# Altium project WR_NIC.PrjPcb (part 2 of 6)

## Sheet 06-General I2C Devices.SchDoc
size B; SheetNumber: 6; SheetTotal: 22
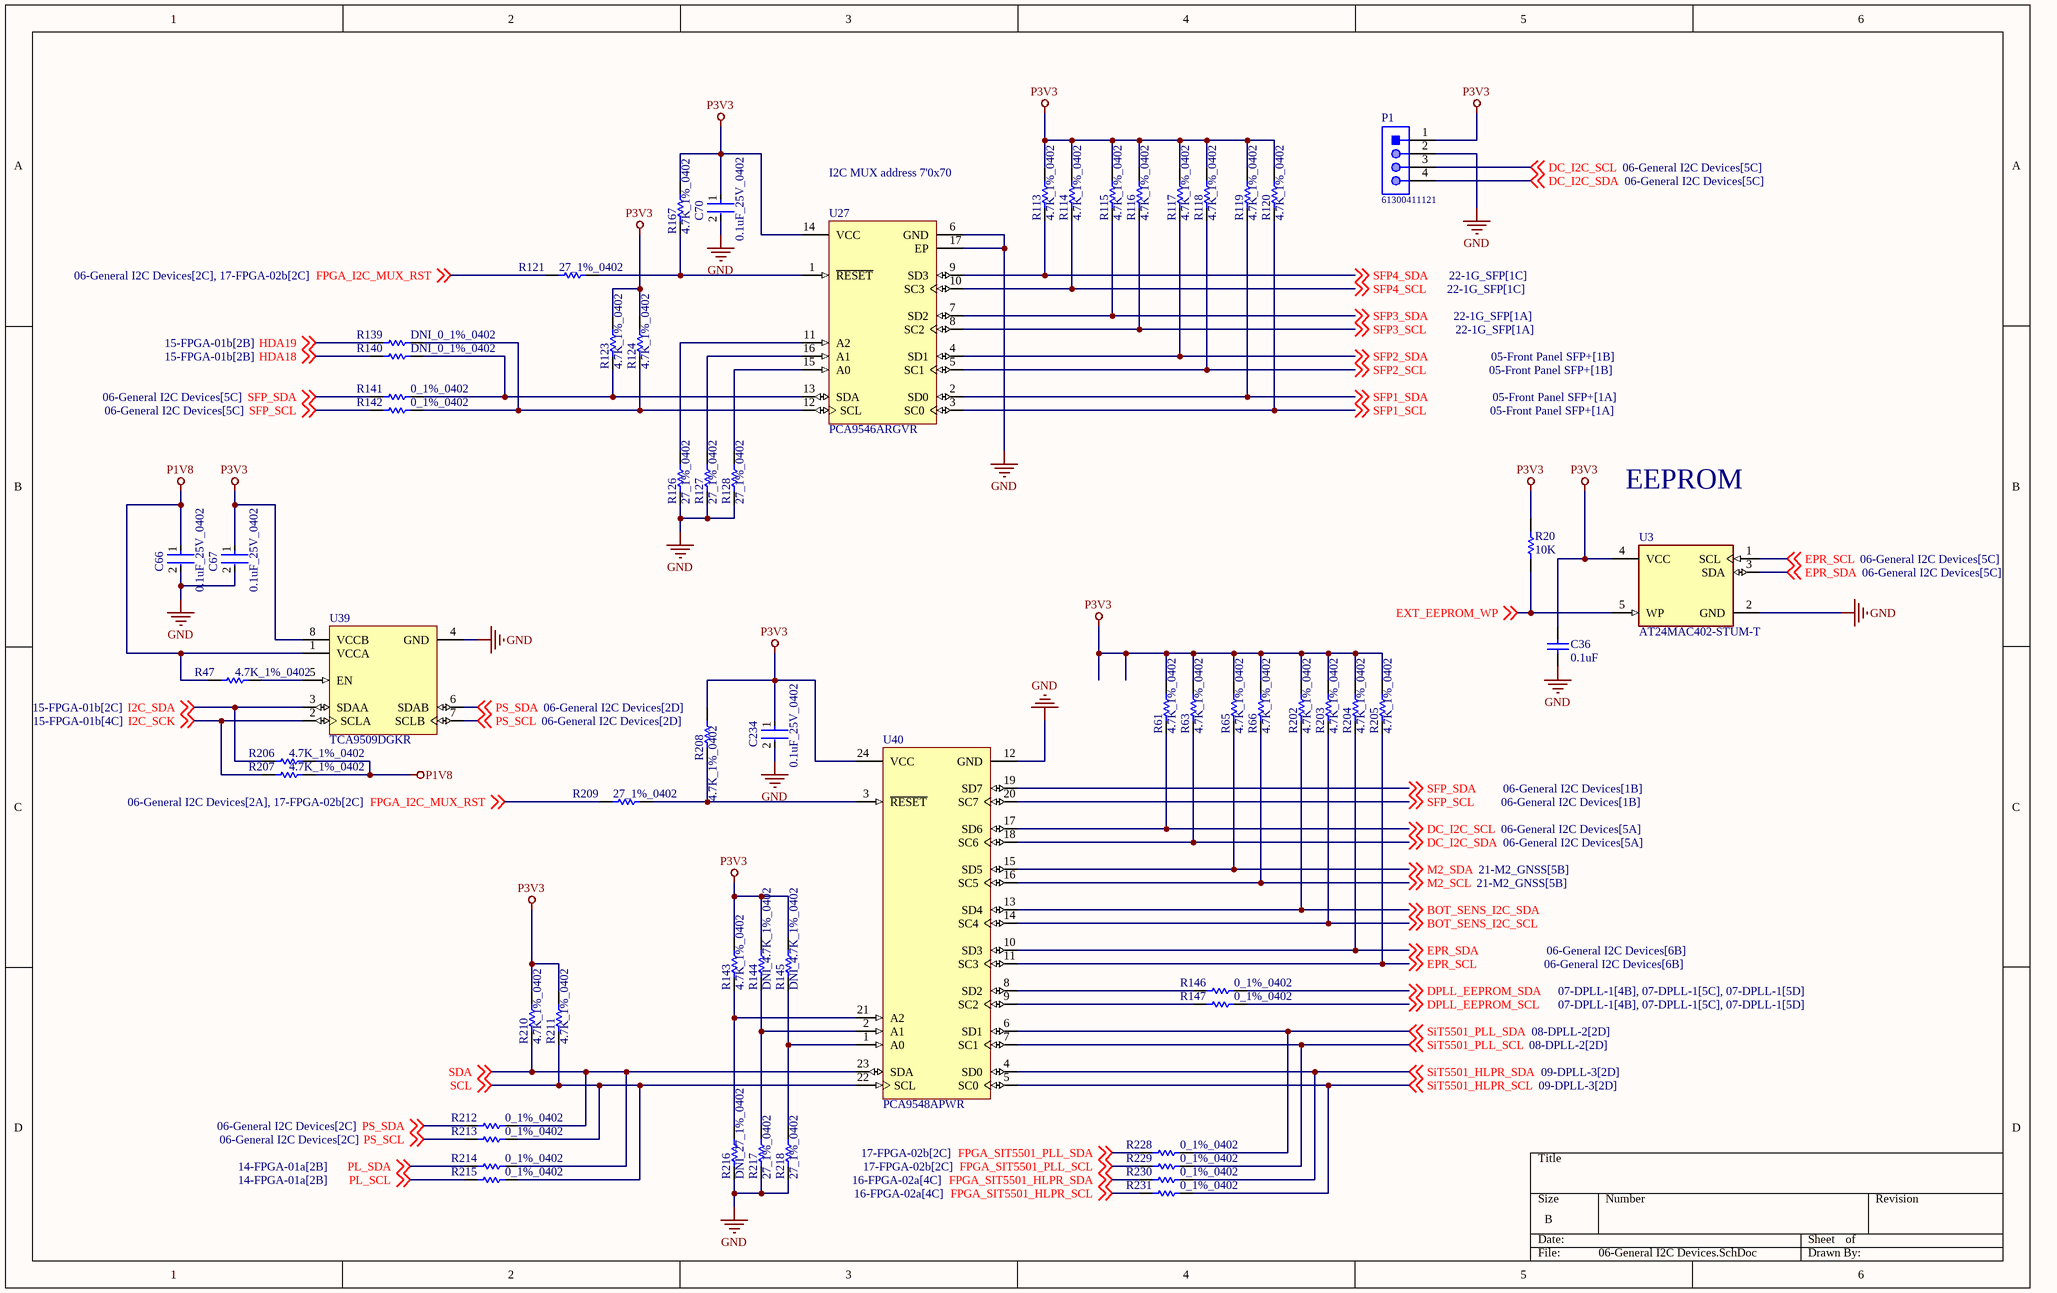
[diagram p5: 06-General I2C Devices.SchDoc]

### Parts
C36  0.1uF  [CAPC1608X87X45ML20T05]
C66  0.1uF_25V_0402  [FP-0402-L_1_0_1-W_0_5_0_1-IPC_C]
C67  0.1uF_25V_0402  [FP-0402-L_1_0_1-W_0_5_0_1-IPC_C]
C70  0.1uF_25V_0402  [FP-0402-L_1_0_1-W_0_5_0_1-IPC_C]
C234  0.1uF_25V_0402  [FP-0402-L_1_0_1-W_0_5_0_1-IPC_C]
P1  61300411121  [61300411121]
R20  10K  [RESC1608X55X30LL15T20]
R47  4.7K_1%_0402  [RESC1005X40X25NL10T10]
R61  4.7K_1%_0402  [RESC1005X40X25NL10T10]
R63  4.7K_1%_0402  [RESC1005X40X25NL10T10]
R65  4.7K_1%_0402  [RESC1005X40X25NL10T10]
R66  4.7K_1%_0402  [RESC1005X40X25NL10T10]
R113  4.7K_1%_0402  [RESC1005X40X25NL10T10]
R114  4.7K_1%_0402  [RESC1005X40X25NL10T10]
R115  4.7K_1%_0402  [RESC1005X40X25NL10T10]
R116  4.7K_1%_0402  [RESC1005X40X25NL10T10]
R117  4.7K_1%_0402  [RESC1005X40X25NL10T10]
R118  4.7K_1%_0402  [RESC1005X40X25NL10T10]
R119  4.7K_1%_0402  [RESC1005X40X25NL10T10]
R120  4.7K_1%_0402  [RESC1005X40X25NL10T10]
R121  27_1%_0402  [RESC1005X40X25NL05T05]
R123  4.7K_1%_0402  [RESC1005X40X25NL10T10]
R124  4.7K_1%_0402  [RESC1005X40X25NL10T10]
R126  27_1%_0402  [RESC1005X40X25NL05T05]
R127  27_1%_0402  [RESC1005X40X25NL05T05]
R128  27_1%_0402  [RESC1005X40X25NL05T05]
R139  DNI_0_1%_0402  [RESC1005X40X25LL05T05]  (no BOM)
R140  DNI_0_1%_0402  [RESC1005X40X25LL05T05]  (no BOM)
R141  0_1%_0402  [RESC1005X40X25LL05T05]
R142  0_1%_0402  [RESC1005X40X25LL05T05]
R143  4.7K_1%_0402  [RESC1005X40X25NL10T10]
R144  DNI_4.7K_1%_0402  [RESC1005X40X25NL10T10]  (no BOM)
R145  DNI_4.7K_1%_0402  [RESC1005X40X25NL10T10]  (no BOM)
R146  0_1%_0402  [RESC1005X40X25LL05T05]
R147  0_1%_0402  [RESC1005X40X25LL05T05]
R167  4.7K_1%_0402  [RESC1005X40X25NL10T10]
R202  4.7K_1%_0402  [RESC1005X40X25NL10T10]
R203  4.7K_1%_0402  [RESC1005X40X25NL10T10]
R204  4.7K_1%_0402  [RESC1005X40X25NL10T10]
R205  4.7K_1%_0402  [RESC1005X40X25NL10T10]
R206  4.7K_1%_0402  [RESC1005X40X25NL10T10]
R207  4.7K_1%_0402  [RESC1005X40X25NL10T10]
R208  4.7K_1%_0402  [RESC1005X40X25NL10T10]
R209  27_1%_0402  [RESC1005X40X25NL05T05]
R210  4.7K_1%_0402  [RESC1005X40X25NL10T10]
R211  4.7K_1%_0402  [RESC1005X40X25NL10T10]
R212  0_1%_0402  [RESC1005X40X25LL05T05]
R213  0_1%_0402  [RESC1005X40X25LL05T05]
R214  0_1%_0402  [RESC1005X40X25LL05T05]
R215  0_1%_0402  [RESC1005X40X25LL05T05]
R216  DNI_27_1%_0402  [RESC1005X40X25NL05T05]  (no BOM)
R217  27_1%_0402  [RESC1005X40X25NL05T05]
R218  27_1%_0402  [RESC1005X40X25NL05T05]
R228  0_1%_0402  [RESC1005X40X25LL05T05]
R229  0_1%_0402  [RESC1005X40X25LL05T05]
R230  0_1%_0402  [RESC1005X40X25LL05T05]
R231  0_1%_0402  [RESC1005X40X25LL05T05]
U3  AT24MAC402-STUM-T  [FP-5TS1-IPC_C]
U27  PCA9546ARGVR  [RGV0016A_V]
U39  TCA9509DGKR  [DGK0008A_L]
U40  PCA9548APWR  [PW0024A_N]

### Nets
GND: C36.1 C66.2 C67.2 C70.2 C234.2 P1.2 R126.1 R127.1 R128.1 R216.1 R217.1 R218.1 U3.2(GND) U27.6(GND) U27.17(EP) U39.4(GND) U40.12(GND)
P1V8: C66.1 R47.2 R206.1 R207.1 U39.1(VCCA)
P3V3: C36.2 C67.1 C70.1 C234.1 P1.1 R20.2 R61.2 R63.2 R65.2 R66.2 R113.2 R114.2 R115.2 R116.2 R117.2 R118.2 R119.2 R120.2 R123.2 R124.2 R143.2 R144.2 R145.2 R167.2 R202.2 R203.2 R204.2 R205.2 R208.2 R210.2 R211.2 U3.4(VCC) U27.14(VCC) U39.8(VCCB) U40.24(VCC)
BOT_SENS_I2C_SCL: R203.1 U40.14(SC4) ; off-sheet BOT_SENS_I2C_SCL
BOT_SENS_I2C_SDA: R202.1 U40.13(SD4) ; off-sheet BOT_SENS_I2C_SDA
DC_I2C_SCL: P1.3 R61.1 U40.17(SD6) ; off-sheet DC_I2C_SCL
DC_I2C_SDA: P1.4 R63.1 U40.18(SC6) ; off-sheet DC_I2C_SDA
DPLL_EEPROM_SCL: R147.2 ; off-sheet DPLL_EEPROM_SCL
DPLL_EEPROM_SDA: R146.2 ; off-sheet DPLL_EEPROM_SDA
EPR_SCL: R205.1 U3.1(SCL) U40.11(SC3) ; off-sheet EPR_SCL
EPR_SDA: R204.1 U3.3(SDA) U40.10(SD3) ; off-sheet EPR_SDA
EXT_EEPROM_WP: R20.1 U3.5(WP) ; off-sheet EXT_EEPROM_WP
FPGA_I2C_MUX_RST: R121.1 R209.1 ; off-sheet FPGA_I2C_MUX_RST
FPGA_SIT5501_HLPR_SCL: R231.1 ; off-sheet FPGA_SIT5501_HLPR_SCL
FPGA_SIT5501_HLPR_SDA: R230.1 ; off-sheet FPGA_SIT5501_HLPR_SDA
FPGA_SIT5501_PLL_SCL: R229.1 ; off-sheet FPGA_SIT5501_PLL_SCL
FPGA_SIT5501_PLL_SDA: R228.1 ; off-sheet FPGA_SIT5501_PLL_SDA
HDA18: R140.1 ; off-sheet HDA18
HDA19: R139.1 ; off-sheet HDA19
I2C_SCK: R207.2 U39.2(SCLA) ; off-sheet I2C_SCK
I2C_SDA: R206.2 U39.3(SDAA) ; off-sheet I2C_SDA
M2_SCL: R66.1 U40.16(SC5) ; off-sheet M2_SCL
M2_SDA: R65.1 U40.15(SD5) ; off-sheet M2_SDA
PL_SCL: R215.1 ; off-sheet PL_SCL
PL_SDA: R214.1 ; off-sheet PL_SDA
PS_SCL: R213.1 U39.7(SCLB) ; off-sheet PS_SCL
PS_SDA: R212.1 U39.6(SDAB) ; off-sheet PS_SDA
SCL: R211.1 R213.2 R215.2 U40.22(SCL) ; off-sheet SCL
SDA: R210.1 R212.2 R214.2 U40.23(SDA) ; off-sheet SDA
SFP1_SCL: R120.1 U27.3(SC0) ; off-sheet SFP1_SCL
SFP1_SDA: R119.1 U27.2(SD0) ; off-sheet SFP1_SDA
SFP2_SCL: R118.1 U27.5(SC1) ; off-sheet SFP2_SCL
SFP2_SDA: R117.1 U27.4(SD1) ; off-sheet SFP2_SDA
SFP3_SCL: R116.1 U27.8(SC2) ; off-sheet SFP3_SCL
SFP3_SDA: R115.1 U27.7(SD2) ; off-sheet SFP3_SDA
SFP4_SCL: R114.1 U27.10(SC3) ; off-sheet SFP4_SCL
SFP4_SDA: R113.1 U27.9(SD3) ; off-sheet SFP4_SDA
SFP_SCL: R142.1 U40.20(SC7) ; off-sheet SFP_SCL
SFP_SDA: R141.1 U40.19(SD7) ; off-sheet SFP_SDA
SiT5501_HLPR_SCL: R231.2 U40.5(SC0) ; off-sheet SiT5501_HLPR_SCL
SiT5501_HLPR_SDA: R230.2 U40.4(SD0) ; off-sheet SiT5501_HLPR_SDA
SiT5501_PLL_SCL: R229.2 U40.7(SC1) ; off-sheet SiT5501_PLL_SCL
SiT5501_PLL_SDA: R228.2 U40.6(SD1) ; off-sheet SiT5501_PLL_SDA
NetR47_1: R47.1 U39.5(EN)
NetR121_2: R121.2 R167.1 U27.1(~{RESET})
NetR123_1: R123.1 R140.2 R141.2 U27.13(SDA)
NetR124_1: R124.1 R139.2 R142.2 U27.12(SCL)
NetR126_2: R126.2 U27.11(A2)
NetR127_2: R127.2 U27.16(A1)
NetR128_2: R128.2 U27.15(A0)
NetR143_1: R143.1 R216.2 U40.21(A2)
NetR144_1: R144.1 R217.2 U40.2(A1)
NetR145_1: R145.1 R218.2 U40.1(A0)
NetR146_1: R146.1 U40.8(SD2)
NetR147_1: R147.1 U40.9(SC2)
NetR208_1: R208.1 R209.2 U40.3(~{RESET})

### Notes on the sheet
- I2C MUX address 7'0x70
- EEPROM

### Library data of the parts
C36 = CMP-2006-00003-1: C0603X104K5RACAUTO; Manufacturer: Kemet; Part Number: C0603X104K5RACAUTO
C66 C67 C70 C234 = CMP-2008-02519-2: as C19 on sheet 01-PCIe; Package Quantity: 1; Capacitance: 100nF; Min Operating Temperature: -55°C; Voltage: 25V; Voltage Rating: 25V; Construction: Flat; Max Operating Temperature: 125°C; Radiation Hardening: No; Depth: 0.5mm; Thickness: 0.022inch; Voltage Rating (DC): 25V; Number of Pins: 2; Lead Free: Lead Free; Series: -; REACH SVHC: No SVHC; Length: 1mm; Dielectric: X7R; RoHS Compliant: Yes; Mount: Surface Mount; Packaging: Tape and Reel; Case/Package: 0402; Case Code (Imperial): 0402; Termination: SMD/SMT; Width: 0.02inch; Case Code (Metric): 1005; Tolerance: 10%
P1 = CMP-1502-01064-1: THT Vertical Pin Header WR-PHD, Pitch 2.54 mm, Single Row, 4 pins; Manufacturer: Wurth Elektronik; Withstanding Voltage: 500VAC; Rated Current: 3A; Working Voltage: 250VAC; Pin Number: 4; Gender: Male; Contact Resistance: 20mOhm; Pitch: 2.54mm; Manufacturer URL: http://www.we-online.de; Operating Temperature: -40to105degC; Packaging: Bag; Mounting Technology: THT; Package Reference: 61300411121; Datasheet URL: https://katalog.we-online.de/em/datasheet/6130xx11121.pdf; Publisher: WurthElektronik; Part Number: 61300411121; Row Number: Single; Orientation: Vertical
R20 = CMP-2000-06990-1: Chip Resistor, 10 KOhm, +/- 1%, 0.1 W, -55 to 155 degC, 0603 (1608 Metric), RoHS, Tape and Reel RMCF0603FT10K0; Manufacturer: Stackpole-Electronics-Inc.; Temperature Coefficient: ±100ppm/°C; Power (Watts): 0.1W,1/10W; Package / Case: 0603(1608Metric); Datasheet Version: 01/2017; Resistance (Ohms): 10k; Features: AutomotiveAEC-Q200; Packaging: CutTape(CT); Series: RMCF; Height: 0.022"(0.55mm); Tolerance: ±1%; Manufacturer URL: https://www.seielect.com/; Datasheet URL: https://www.seielect.com/Catalog/SEI-RMCF_RMCP.pdf; Supplier Device Package: 0603; Number of Terminations: 2; Family: ChipResistor-SurfaceMount; Package Reference: 0603; Size / Dimension: 0.061"Lx0.031"W(1.55mmx0.80mm); Mounting Technology: SurfaceMount; Package Description: 2-Pin Surface Mount Device, Body 1.55 x 0.8 mm; Operating Temperature: -55°C~155°C; Composition: ThickFilm; Category: Resistors
R47 R61 R63 R65 R66 R113-R120 R123 R124 R143-R145 R167 R202-R208 R210 R211 = CMP-2002-05217-1: as R18 on sheet 01-PCIe
R121 R126-R128 R209 R216-R218 = CMP-2002-08434-1: as R112 on sheet 05-Front Panel SFP+
R139-R142 R146 R147 R212-R215 R228-R231 = CMP-2000-07451-1: as R1 on sheet 01-PCIe; Number of Terminations: 2; Mount: SurfaceMount; Height: 0.35mm; Packaging: TapeandReel; Contact Plating: Tin; Manufacturer URL: http://www.panasonic.com/; Composition: ThickFilm; Max Operating Temperature: 155degC; REACH SVHC: NoSVHC; Case/Package: 0402; Package Reference: 402; Depth: 0.5mm; Package Description: 2-Pin Surface Mount Device, Body 1 x 0.5 mm; Datasheet URL: https://industrial.panasonic.com/cdbs/www-data/pdf/RDA0000/AOA0000C301.pdf; RoHSCompliant: True; Case Code (Imperial): 0402; Military Standard: Not; Min Operating Temperature: -55degC; Power Rating: 100mW; Datasheet Version: 03/2015; Length: 1mm; Case Code (Metric): 1005; Termination: SMD/SMT; Mounting Technology: SurfaceMount; Voltage Rating: 50V; Width: 0.02inch; Package Quantity: 1; Lead Free: LeadFree; Radiation Hardening: No
U3 = CMP-06313-000011-1: IC EEPROM 2K I2C 1MHZ SOT23-5; Manufacturer: Microchip; Memory Size: 2Kbits; Min Supply Voltage: 1.7V; Max Supply Voltage: 5.5V; Frequency: 1000kHz; Standoff Height: 0mm; Nominal Supply Current: 0.4-2mA; Access Time: 0.55us; Interface: I2C,2-Wire; Temperature Range Low: -40°C; Height: 1mm; ComponentLink2URL: http://ww1.microchip.com/downloads/en/DeviceDoc/Atmel-8807-SEEPROM-AT24MAC402-602-Datasheet.pdf; Ipc Land Pattern Name: SOT95P280X100-5; Category: IC; Memory Type: EEPROM; Digikey Description: IC EEPROM 2K I2C 1MHZ SOT23-5; Manufacturer Part Number: AT24MAC402-STUM-T; Device Class L1: Integrated Circuits (ICs); Temperature Range High: +85°C; ComponentLink2Description: Datasheet; RoHS: TRUE; Mouser Description: EEPROM Serial-I2C 2K-bit 256 x 8 1.8V/2.5V/3.3V/5V 5-Pin SOT-23 T/R; Octopart: https://octopart.com/at24mac402-stum-t-microchip-77758112; Temperature: -40°C to +85°C; Package: 5TS1; Device Class L3: EEPROM; Automotive: No; Device Class L2: Memory; Lead Free: Yes
U27 = CMP-0314-00065-2: 4-Channel I2C and SMBus Multiplexer with Reset Functions, 2.3 to 5.5 V, -40 to 85 degC, 16-pin VQFN (RGV), Green (RoHS & no Sb/Br); Manufacturer: Texas Instruments; fSCLK(Max)(MHz): 100, 400; I2C Address: 1110 xxx; VCC(Min)(V): 2.3; 5V Tolerant I/O: Yes; Channel Width: 4; VCC(Max)(V): 5.5; tpd max(ns): 0.3, 1; Simultaneously Active Channels: 1 to 4; Max Frequency(kHz): 400; SubFamily: I2C Multiplexer, Switch; Mounting Technology: Surface Mount; ComponentLink2Description: Package Specification; DatasheetVersion: SCPS148E; PackageDescription: 16-Pin Plastic Quad Flat No-Lead, 4 x 4 mm Body, 0.65 mm Pitch, 2.16 x 2.16 mm Exposed Pad; PackageVersion: revF, Jun-2011; ComponentLink1URL: http://www.ti.com/general/docs/lit/getliterature.tsp?genericPartNumber=PCA9546A&fileType=pdf; Eco-Plan: Green (RoHS & no Sb/Br); Reset Input: Yes; Vcc range(V): 2.3 to 5.5; ComponentLink2URL: http://www.ti.com/litv/pdf/mpds178g; Open Drain I/O Type: Yes; PackageReference: RGV0016A; PartNumber: PCA9546ARGVR; ComponentLink1Description: Datasheet
U39 = CMP-0314-00313-2: Level Translating I2C Bus Repeater, 2.7 to 5.5 V, -40 to 85 degC, 8-pin MSOP (DGK), Green (RoHS & no Sb/Br); Manufacturer: Texas Instruments; Slave Side I2C Bus Capacitance Supported(pF): 400; Open Drain I/O Type: Yes; SubFamily: I2C Hub, Buffer, Repeater; VCC(Max)(V): 5.5; VCC(Min)(V): 2.7; fSCLK(Max)(MHz): 0.4; ComponentLink2URL: http://www.ti.com/litv/pdf/msoi002j; PartNumber: TCA9509DGKR; ComponentLink1URL: http://www.ti.com/general/docs/lit/getliterature.tsp?genericPartNumber=TCA9509&fileType=pdf; Code_JEDEC: MO-187-AA; ComponentLink2Description: Package Specification; DatasheetVersion: SCPS225B; PackageVersion: revE, May-2006; Eco-Plan: Green (RoHS & no Sb/Br); Max Frequency(kHz): 400; ComponentLink1Description: Datasheet; Vcc range(V): 2.7 to 5.5; Mounting Technology: Surface Mount; PackageDescription: 8-Pin Thin Small Outline Package 3 x 3 mm Body ,0.65 mm Pitch; PackageReference: DGK0008A; Enable Pin: Yes; Master Side I2C Bus Capacitance Supported(pF): 400
U40 = CMP-0314-00341-2: 8-Channel I2C Switch with Reset, 2.3 to 5.5 V, -40 to 85 degC, 24-pin TSSOP (PW), Green (RoHS & no Sb/Br); Manufacturer: Texas Instruments; Reset Input: Yes; I2C Address: 1110 xxx; VCC(Max)(V): 5.5; Channel Width: 8; fSCLK(Max)(MHz): 100, 400; SubFamily: I2C Multiplexer, Switch; VCC(Min)(V): 2.3; Simultaneously Active Channels: 1 to 8; Max Frequency(kHz): 400; Technology Family: PCA; ComponentLink2Description: Package Specification; DatasheetVersion: SCPS143C; Code_JEDEC: MO-153; Eco-Plan: Green (RoHS & no Sb/Br); PartNumber: PCA9548APWR; PackageReference: PW0024A; PackageDescription: 24-Pin Thin Small Outline Package 0.65 mm Pitch; Vcc range(V): 2.3 to 5.5; ComponentLink1Description: Datasheet; ComponentLink1URL: http://www.ti.com/general/docs/lit/getliterature.tsp?genericPartNumber=PCA9548A&fileType=pdf; Open Drain I/O Type: Yes; 5V Tolerant I/O: Yes; PackageVersion: revG, Feb-2011; Mounting Technology: Surface Mount; ComponentLink2URL: http://www.ti.com/litv/pdf/mpds177g

## Sheet 07-DPLL-1.SchDoc
size B; SheetNumber: 7; SheetTotal: 22
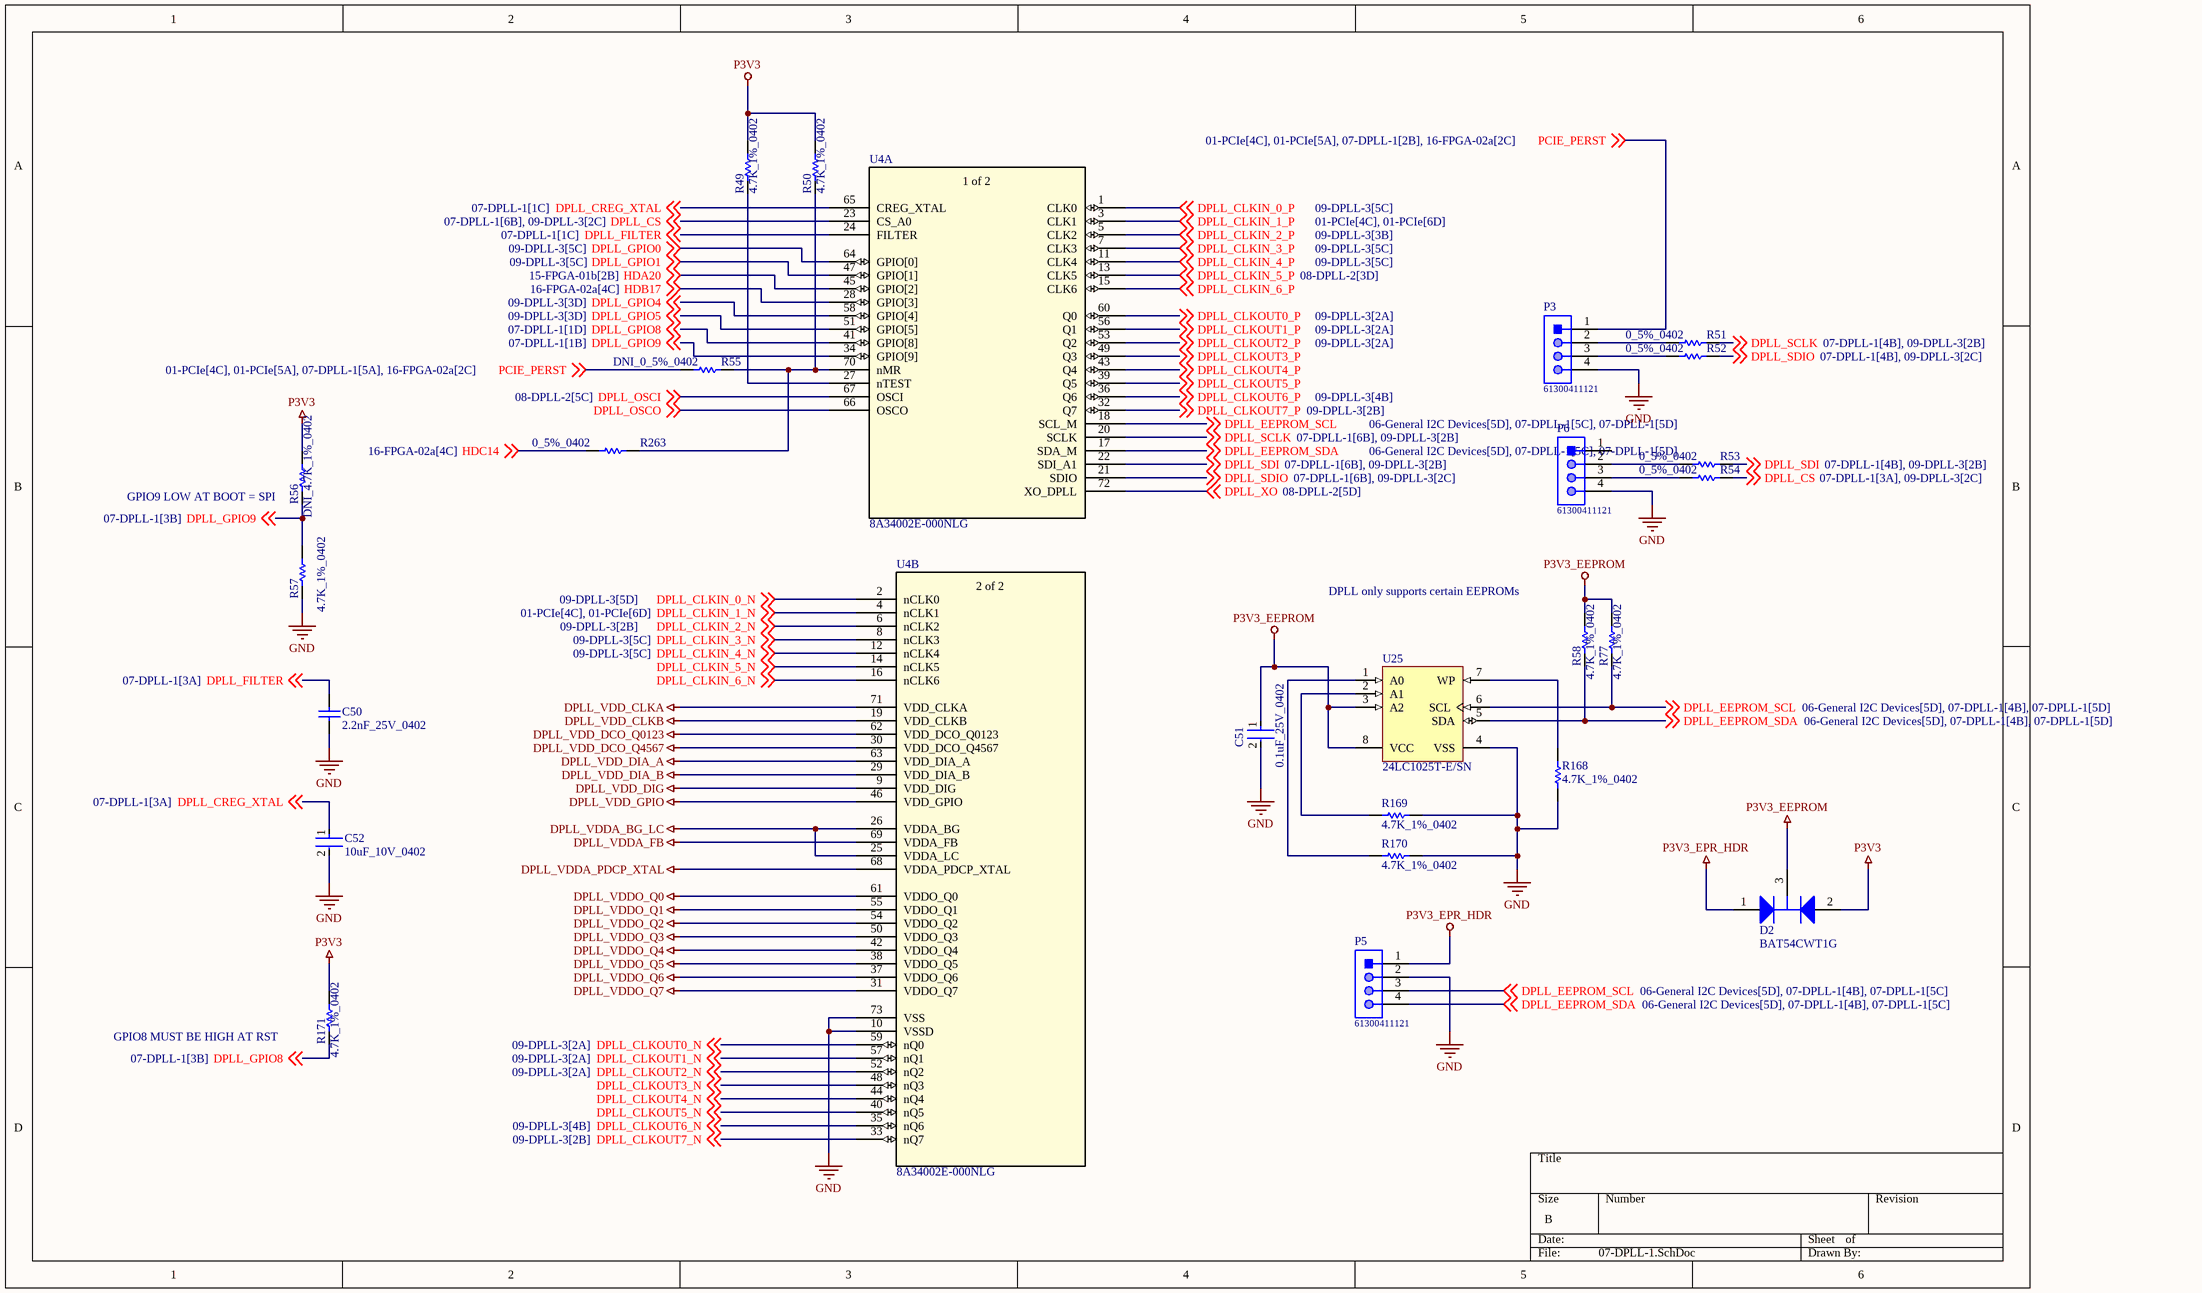
[diagram p6: 07-DPLL-1.SchDoc]

### Parts
C50  2.2nF_25V_0402  [CAPC1005X56X25LL10T15]
C51  0.1uF_25V_0402  [FP-0402-L_1_0_1-W_0_5_0_1-IPC_C]
C52  10uF_10V_0402  [FP-CL05A106MP5NUNC-MFG]
D2  BAT54CWT1G  [ONSC-SOT-323-3-419-04_V]
P3  61300411121  [61300411121]
P5  61300411121  [61300411121]
P6  61300411121  [61300411121]
R49  4.7K_1%_0402  [RESC1005X40X25NL10T10]
R50  4.7K_1%_0402  [RESC1005X40X25NL10T10]
R51  0_5%_0402  [RESC1005X40X25LL10T10]
R52  0_5%_0402  [RESC1005X40X25LL10T10]
R53  0_5%_0402  [RESC1005X40X25LL10T10]
R54  0_5%_0402  [RESC1005X40X25LL10T10]
R55  DNI_0_5%_0402  [RESC1005X40X25LL10T10]  (no BOM)
R56  DNI_4.7K_1%_0402  [RESC1005X40X25NL10T10]  (no BOM)
R57  4.7K_1%_0402  [RESC1005X40X25NL10T10]
R58  4.7K_1%_0402  [RESC1005X40X25NL10T10]
R77  4.7K_1%_0402  [RESC1005X40X25NL10T10]
R168  4.7K_1%_0402  [RESC1005X40X25NL10T10]
R169  4.7K_1%_0402  [RESC1005X40X25NL10T10]
R170  4.7K_1%_0402  [RESC1005X40X25NL10T10]
R171  4.7K_1%_0402  [RESC1005X40X25NL10T10]
R263  0_5%_0402  [RESC1005X40X25LL10T10]
U4  8A34002E-000NLG  [QFN_2E-000NLG_REN]  (parts A,B of 2)
U25  24LC1025T-E/SN  [SOIC-SN8_M]

### Nets
DPLL_VDD_CLKA: U4.71(VDD_CLKA)
DPLL_VDD_CLKB: U4.19(VDD_CLKB)
DPLL_VDD_DCO_Q0123: U4.62(VDD_DCO_Q0123)
DPLL_VDD_DCO_Q4567: U4.30(VDD_DCO_Q4567)
DPLL_VDD_DIA_A: U4.63(VDD_DIA_A)
DPLL_VDD_DIA_B: U4.29(VDD_DIA_B)
DPLL_VDD_DIG: U4.9(VDD_DIG)
DPLL_VDD_GPIO: U4.46(VDD_GPIO)
DPLL_VDDA_BG_LC: U4.25(VDDA_LC) U4.26(VDDA_BG)
DPLL_VDDA_FB: U4.69(VDDA_FB)
DPLL_VDDA_PDCP_XTAL: U4.68(VDDA_PDCP_XTAL)
DPLL_VDDO_Q0: U4.61(VDDO_Q0)
DPLL_VDDO_Q1: U4.55(VDDO_Q1)
DPLL_VDDO_Q2: U4.54(VDDO_Q2)
DPLL_VDDO_Q3: U4.50(VDDO_Q3)
DPLL_VDDO_Q4: U4.42(VDDO_Q4)
DPLL_VDDO_Q5: U4.38(VDDO_Q5)
DPLL_VDDO_Q6: U4.37(VDDO_Q6)
DPLL_VDDO_Q7: U4.31(VDDO_Q7)
GND: C50.1 C51.2 C52.2 P3.4 P5.2 P6.4 R57.1 R168.2 R169.1 R170.2 U4.10(VSSD) U4.73(VSS) U25.4(VSS)
P3V3: D2.2(A2) R49.2 R50.2 R56.1 R171.1
P3V3_EEPROM: C51.1 D2.3(K) R58.1 R77.1 U25.3(A2) U25.8(VCC)
P3V3_EPR_HDR: D2.1(A1) P5.1
DPLL_CLKIN_0_N: U4.2(nCLK0) ; off-sheet DPLL_CLKIN_0_N
DPLL_CLKIN_0_P: U4.1(CLK0) ; off-sheet DPLL_CLKIN_0_P
DPLL_CLKIN_1_N: U4.4(nCLK1) ; off-sheet DPLL_CLKIN_1_N
DPLL_CLKIN_1_P: U4.3(CLK1) ; off-sheet DPLL_CLKIN_1_P
DPLL_CLKIN_2_N: U4.6(nCLK2) ; off-sheet DPLL_CLKIN_2_N
DPLL_CLKIN_2_P: U4.5(CLK2) ; off-sheet DPLL_CLKIN_2_P
DPLL_CLKIN_3_N: U4.8(nCLK3) ; off-sheet DPLL_CLKIN_3_N
DPLL_CLKIN_3_P: U4.7(CLK3) ; off-sheet DPLL_CLKIN_3_P
DPLL_CLKIN_4_N: U4.12(nCLK4) ; off-sheet DPLL_CLKIN_4_N
DPLL_CLKIN_4_P: U4.11(CLK4) ; off-sheet DPLL_CLKIN_4_P
DPLL_CLKIN_5_N: U4.14(nCLK5) ; off-sheet DPLL_CLKIN_5_N
DPLL_CLKIN_5_P: U4.13(CLK5) ; off-sheet DPLL_CLKIN_5_P
DPLL_CLKIN_6_N: U4.16(nCLK6) ; off-sheet DPLL_CLKIN_6_N
DPLL_CLKIN_6_P: U4.15(CLK6) ; off-sheet DPLL_CLKIN_6_P
DPLL_CLKOUT0_N: U4.59(nQ0) ; off-sheet DPLL_CLKOUT0_N
DPLL_CLKOUT0_P: U4.60(Q0) ; off-sheet DPLL_CLKOUT0_P
DPLL_CLKOUT1_N: U4.57(nQ1) ; off-sheet DPLL_CLKOUT1_N
DPLL_CLKOUT1_P: U4.56(Q1) ; off-sheet DPLL_CLKOUT1_P
DPLL_CLKOUT2_N: U4.52(nQ2) ; off-sheet DPLL_CLKOUT2_N
DPLL_CLKOUT2_P: U4.53(Q2) ; off-sheet DPLL_CLKOUT2_P
DPLL_CLKOUT3_N: U4.48(nQ3) ; off-sheet DPLL_CLKOUT3_N
DPLL_CLKOUT3_P: U4.49(Q3) ; off-sheet DPLL_CLKOUT3_P
DPLL_CLKOUT4_N: U4.44(nQ4) ; off-sheet DPLL_CLKOUT4_N
DPLL_CLKOUT4_P: U4.43(Q4) ; off-sheet DPLL_CLKOUT4_P
DPLL_CLKOUT5_N: U4.40(nQ5) ; off-sheet DPLL_CLKOUT5_N
DPLL_CLKOUT5_P: U4.39(Q5) ; off-sheet DPLL_CLKOUT5_P
DPLL_CLKOUT6_N: U4.35(nQ6) ; off-sheet DPLL_CLKOUT6_N
DPLL_CLKOUT6_P: U4.36(Q6) ; off-sheet DPLL_CLKOUT6_P
DPLL_CLKOUT7_N: U4.33(nQ7) ; off-sheet DPLL_CLKOUT7_N
DPLL_CLKOUT7_P: U4.32(Q7) ; off-sheet DPLL_CLKOUT7_P
DPLL_CREG_XTAL: C52.1 U4.65(CREG_XTAL) ; off-sheet DPLL_CREG_XTAL
DPLL_CS: R54.2 U4.23(CS_A0) ; off-sheet DPLL_CS
DPLL_EEPROM_SCL: P5.3 R77.2 U4.18(SCL_M) U25.6(SCL) ; off-sheet DPLL_EEPROM_SCL
DPLL_EEPROM_SDA: P5.4 R58.2 U4.17(SDA_M) U25.5(SDA) ; off-sheet DPLL_EEPROM_SDA
DPLL_FILTER: C50.2 U4.24(FILTER) ; off-sheet DPLL_FILTER
DPLL_GPIO0: U4.64(GPIO[0]) ; off-sheet DPLL_GPIO0
DPLL_GPIO1: U4.47(GPIO[1]) ; off-sheet DPLL_GPIO1
DPLL_GPIO4: U4.58(GPIO[4]) ; off-sheet DPLL_GPIO4
DPLL_GPIO5: U4.51(GPIO[5]) ; off-sheet DPLL_GPIO5
DPLL_GPIO8: R171.2 U4.41(GPIO[8]) ; off-sheet DPLL_GPIO8
DPLL_GPIO9: R56.2 R57.2 U4.34(GPIO[9]) ; off-sheet DPLL_GPIO9
DPLL_OSCI: U4.67(OSCI) ; off-sheet DPLL_OSCI
DPLL_OSCO: U4.66(OSCO) ; off-sheet DPLL_OSCO
DPLL_SCLK: R51.2 U4.20(SCLK) ; off-sheet DPLL_SCLK
DPLL_SDI: R53.2 U4.22(SDI_A1) ; off-sheet DPLL_SDI
DPLL_SDIO: R52.2 U4.21(SDIO) ; off-sheet DPLL_SDIO
DPLL_XO: U4.72(XO_DPLL) ; off-sheet DPLL_XO
HDA20: U4.45(GPIO[2]) ; off-sheet HDA20
HDB17: U4.28(GPIO[3]) ; off-sheet HDB17
HDC14: R263.1 ; off-sheet HDC14
PCIE_PERST: P3.1 R55.1 ; off-sheet PCIE_PERST
NetP3_2: P3.2 R51.1
NetP3_3: P3.3 R52.1
NetP6_2: P6.2 R53.1
NetP6_3: P6.3 R54.1
NetR49_1: R49.1 U4.27(nTEST)
NetR50_1: R50.1 R55.2 R263.2 U4.70(nMR)
NetR168_1: R168.1 U25.7(WP)
NetR169_2: R169.2 U25.2(A1)
NetR170_1: R170.1 U25.1(A0)

Not connected (* = marked no-connect by the designer): P6 1

### Notes on the sheet
- (near R56) GPIO9 LOW AT BOOT = SPI
- DPLL only supports certain EEPROMs
- GPIO8 MUST BE HIGH AT RST
- (in symbol 8A34002E-000NLG, part A) 1 of 2
- (in symbol 8A34002E-000NLG, part B) 2 of 2

### Library data of the parts
C50 = CMP-2008-02907-1: Manufacturer: AVX Interconnect / Elco; Part Number: 04025C222JAT2A
C51 = CMP-2008-02519-2: as C19 on sheet 01-PCIe; Package Quantity: 1; Capacitance: 100nF; Min Operating Temperature: -55°C; Voltage: 25V; Voltage Rating: 25V; Construction: Flat; Max Operating Temperature: 125°C; Radiation Hardening: No; Depth: 0.5mm; Thickness: 0.022inch; Voltage Rating (DC): 25V; Number of Pins: 2; Lead Free: Lead Free; Series: -; REACH SVHC: No SVHC; Length: 1mm; Dielectric: X7R; RoHS Compliant: Yes; Mount: Surface Mount; Packaging: Tape and Reel; Case/Package: 0402; Case Code (Imperial): 0402; Termination: SMD/SMT; Width: 0.02inch; Case Code (Metric): 1005; Tolerance: 10%
C52 = CMP-13271-000002-1: CAP CER 10UF 10V X5R 0402; Manufacturer Part Number: CL05A106MP5NUNC; Manufacturer: Samsung; Temperature Coefficient: 15%; Tolerance: 20%; Material: Ceramic; Octopart: https://octopart.com/cl05a106mp5nunc-samsung-22457395; Voltage Rating: 10V; RoHS: TRUE; Value: 10uF; Height: 0.7mm; Digikey Description: CAP CER 10UF 10V X5R 0402; Automotive: No; Package: CL05A106MP5NUNC; Device Class L1: Passive Components; Capacitance: 10uF; Temperature Range High: +85°C; ComponentLink2Description: Datasheet; Device Class L2: Capacitors; Temperature Characteristic: X5R; Temperature: -55°C to +85°C; ComponentLink2URL: http://www.samsungsem.com/kr/support/product-search/mlcc/__icsFiles/afieldfile/2019/05/10/19-CL05A106MP5NUNC.pdf; Device Class L3: Ceramic Capacitors; Category: Cap; Temperature Range Low: -55°C; Ipc Land Pattern Name: CAPC10050X50; Lead Free: Yes
D2 = CMP-1055-00557-1: Dual Series Cathode Schottky Barrier Diodes, 3-Pin SOT-323, Pb-Free, Tape and Reel; Manufacturer: On Semiconductor; Configuration: Common Cathode; IFSM Max (A): 0.6; trr Max (ns): 5; ComponentLink2Description: Datasheet; Packing: Tape and Reel; ComponentLink3Description: Package Specification; Mounting Technology: Surface Mount; PartNumber: BAT54CWT1G; PackageVersion: Rev. N, 11/2008; RoHS: TRUE; ComponentLink3URL: http://www.onsemi.com/pub_link/Collateral/419-04.PDF; ComponentLink2URL: http://www.onsemi.cn/pub_link/Collateral/BAT54CWT1-D.PDF; PackageReference: SOT-323-3-419-04; ComponentLink1URL: http://www.onsemi.com/; ComponentLink1Description: Manufacturer URL; DatasheetVersion: Rev. 7; PackageDescription: 3-Pin Small Outline Transistor, Body 2 x 1.25 mm, Pitch 0.65 mm
P3 P5 P6 = CMP-1502-01064-1: as P1 on sheet 06-General I2C Devices; Manufacturer URL: http://www.we-online.de; Operating Temperature: -40to105degC; Packaging: Bag; Mounting Technology: THT; Package Reference: 61300411121; Datasheet URL: https://katalog.we-online.de/em/datasheet/6130xx11121.pdf; Publisher: WurthElektronik; Part Number: 61300411121; Row Number: Single; Orientation: Vertical
R49 R50 R56-R58 R77 R168-R171 = CMP-2002-05217-1: as R18 on sheet 01-PCIe
R51-R55 R263 = CMP-2002-04569-1: as R42 on sheet 01-PCIe
U4 = 8A34002E-000NLG: No Description Available; Mfr_Name: Renesas Electronics; RefDes: RefDes; Type: Type
U25 = CMP-0159-00340-1: 1 Mbit, 400kHz, 2.5V, 8-Pin SOIC 150mil, Extended Temperature, Tape and Reel; Code_JEDEC: MS-012; PackageVersion: revBB, Aug-2009; PackageDescription: 8-Lead Plastic Small Outline (SN) - Narrow, 3.90mm Body [SOIC]; DatasheetVersion: revF, Oct-2008; PackageReference: SOIC-SN8; Code_IPC: SOIC127P600-8

## Sheet 08-DPLL-2.SchDoc
size B; SheetNumber: 8; SheetTotal: 22
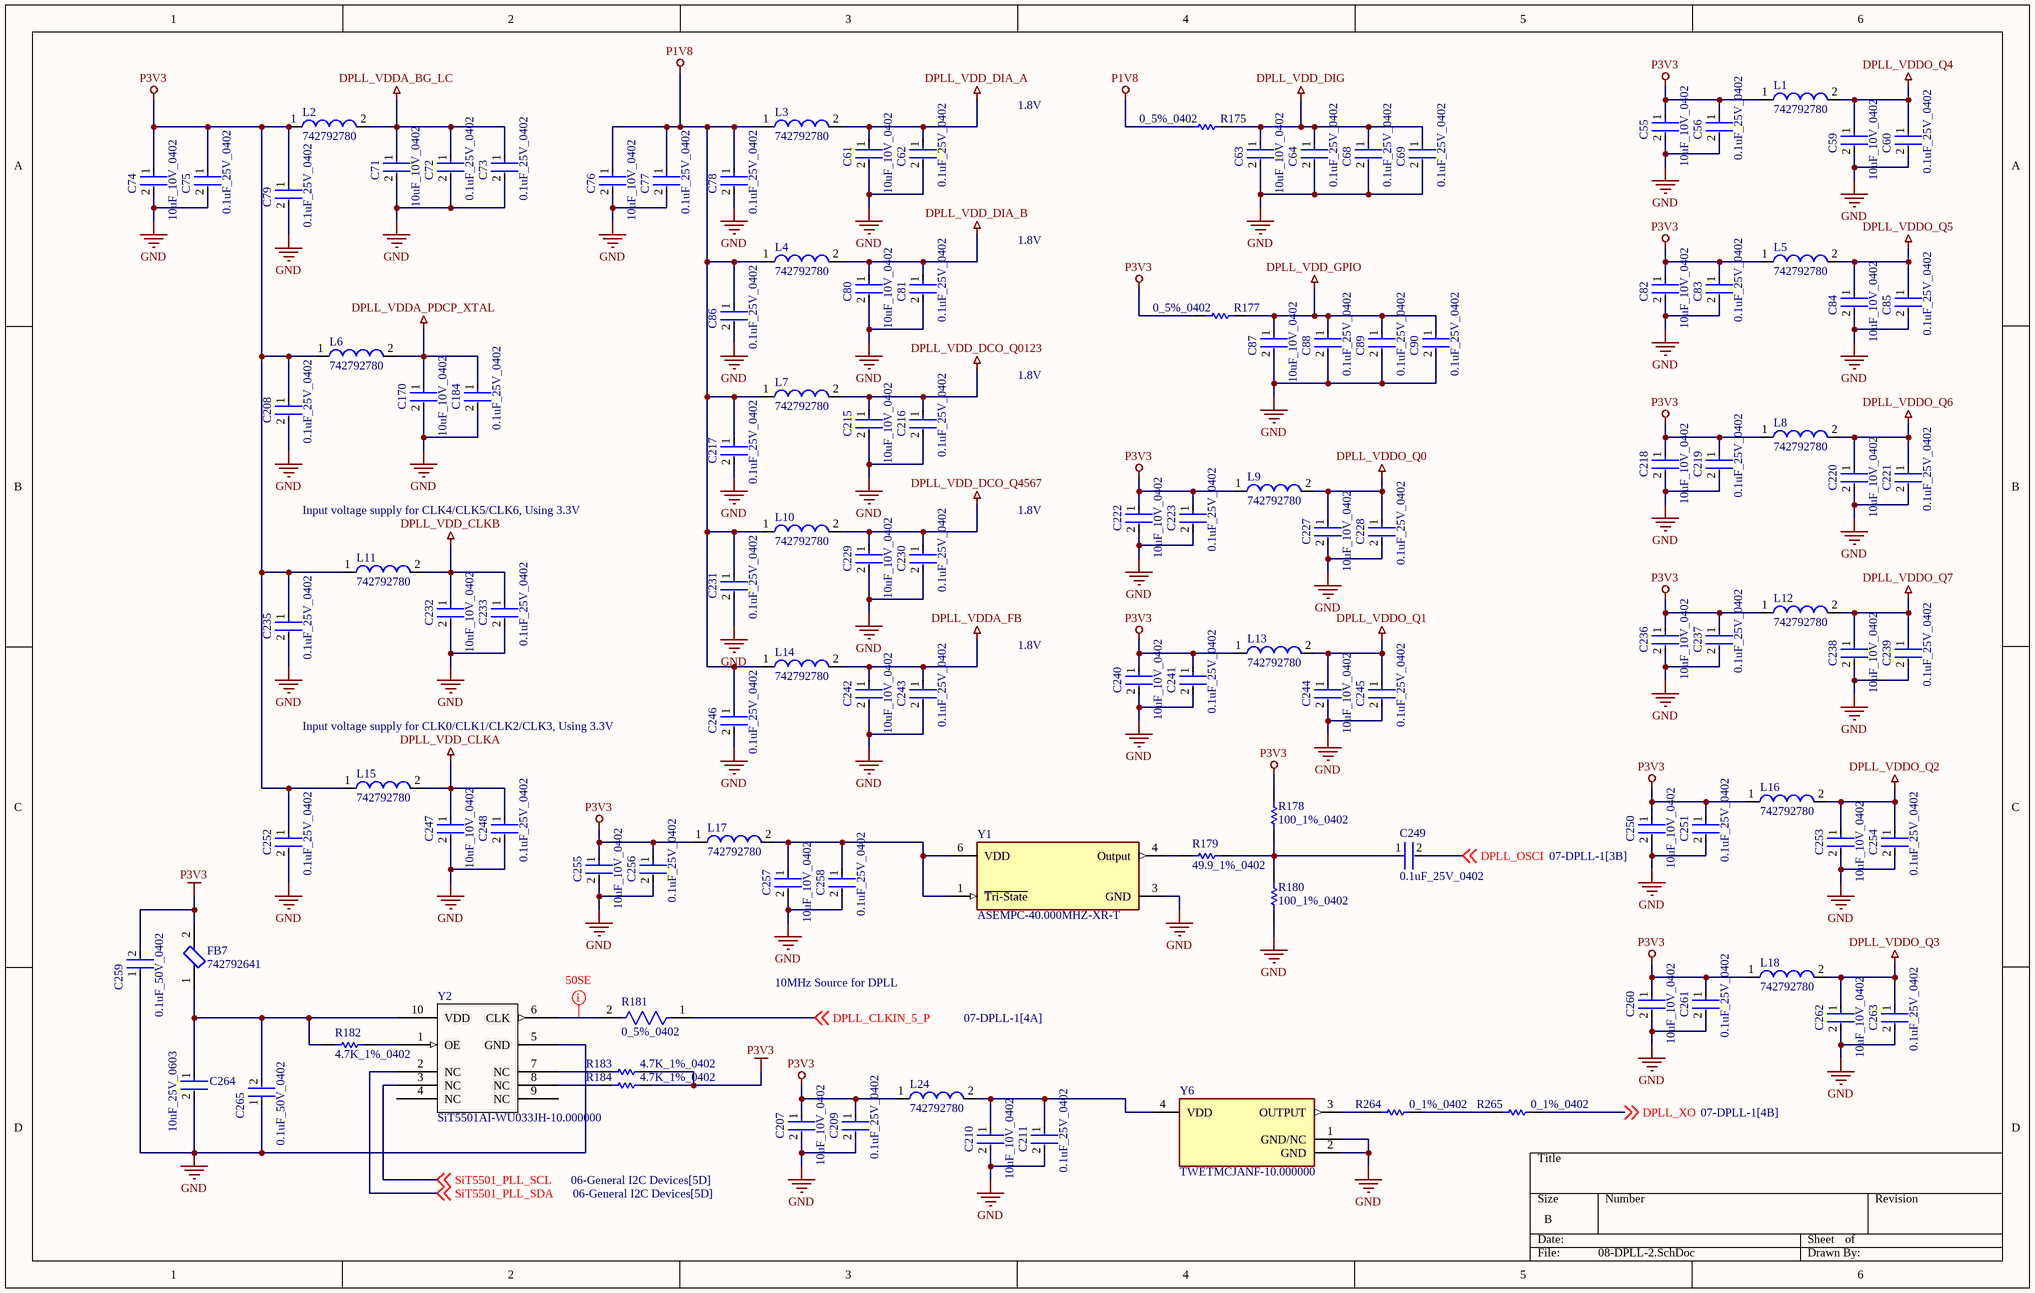
[diagram p7: 08-DPLL-2.SchDoc]

### Parts
C55  10uF_10V_0402  [FP-CL05A106MP5NUNC-MFG]
C56  0.1uF_25V_0402  [FP-0402-L_1_0_1-W_0_5_0_1-IPC_C]
C59  10uF_10V_0402  [FP-CL05A106MP5NUNC-MFG]
C60  0.1uF_25V_0402  [FP-0402-L_1_0_1-W_0_5_0_1-IPC_C]
C61  10uF_10V_0402  [FP-CL05A106MP5NUNC-MFG]
C62  0.1uF_25V_0402  [FP-0402-L_1_0_1-W_0_5_0_1-IPC_C]
C63  10uF_10V_0402  [FP-CL05A106MP5NUNC-MFG]
C64  0.1uF_25V_0402  [FP-0402-L_1_0_1-W_0_5_0_1-IPC_C]
C68  0.1uF_25V_0402  [FP-0402-L_1_0_1-W_0_5_0_1-IPC_C]
C69  0.1uF_25V_0402  [FP-0402-L_1_0_1-W_0_5_0_1-IPC_C]
C71  10uF_10V_0402  [FP-CL05A106MP5NUNC-MFG]
C72  0.1uF_25V_0402  [FP-0402-L_1_0_1-W_0_5_0_1-IPC_C]
C73  0.1uF_25V_0402  [FP-0402-L_1_0_1-W_0_5_0_1-IPC_C]
C74  10uF_10V_0402  [FP-CL05A106MP5NUNC-MFG]
C75  0.1uF_25V_0402  [FP-0402-L_1_0_1-W_0_5_0_1-IPC_C]
C76  10uF_10V_0402  [FP-CL05A106MP5NUNC-MFG]
C77  0.1uF_25V_0402  [FP-0402-L_1_0_1-W_0_5_0_1-IPC_C]
C78  0.1uF_25V_0402  [FP-0402-L_1_0_1-W_0_5_0_1-IPC_C]
C79  0.1uF_25V_0402  [FP-0402-L_1_0_1-W_0_5_0_1-IPC_C]
C80  10uF_10V_0402  [FP-CL05A106MP5NUNC-MFG]
C81  0.1uF_25V_0402  [FP-0402-L_1_0_1-W_0_5_0_1-IPC_C]
C82  10uF_10V_0402  [FP-CL05A106MP5NUNC-MFG]
C83  0.1uF_25V_0402  [FP-0402-L_1_0_1-W_0_5_0_1-IPC_C]
C84  10uF_10V_0402  [FP-CL05A106MP5NUNC-MFG]
C85  0.1uF_25V_0402  [FP-0402-L_1_0_1-W_0_5_0_1-IPC_C]
C86  0.1uF_25V_0402  [FP-0402-L_1_0_1-W_0_5_0_1-IPC_C]
C87  10uF_10V_0402  [FP-CL05A106MP5NUNC-MFG]
C88  0.1uF_25V_0402  [FP-0402-L_1_0_1-W_0_5_0_1-IPC_C]
C89  0.1uF_25V_0402  [FP-0402-L_1_0_1-W_0_5_0_1-IPC_C]
C90  0.1uF_25V_0402  [FP-0402-L_1_0_1-W_0_5_0_1-IPC_C]
C170  10uF_10V_0402  [FP-CL05A106MP5NUNC-MFG]
C184  0.1uF_25V_0402  [FP-0402-L_1_0_1-W_0_5_0_1-IPC_C]
C207  10uF_10V_0402  [FP-CL05A106MP5NUNC-MFG]
C208  0.1uF_25V_0402  [FP-0402-L_1_0_1-W_0_5_0_1-IPC_C]
C209  0.1uF_25V_0402  [FP-0402-L_1_0_1-W_0_5_0_1-IPC_C]
C210  10uF_10V_0402  [FP-CL05A106MP5NUNC-MFG]
C211  0.1uF_25V_0402  [FP-0402-L_1_0_1-W_0_5_0_1-IPC_C]
C215  10uF_10V_0402  [FP-CL05A106MP5NUNC-MFG]
C216  0.1uF_25V_0402  [FP-0402-L_1_0_1-W_0_5_0_1-IPC_C]
C217  0.1uF_25V_0402  [FP-0402-L_1_0_1-W_0_5_0_1-IPC_C]
C218  10uF_10V_0402  [FP-CL05A106MP5NUNC-MFG]
C219  0.1uF_25V_0402  [FP-0402-L_1_0_1-W_0_5_0_1-IPC_C]
C220  10uF_10V_0402  [FP-CL05A106MP5NUNC-MFG]
C221  0.1uF_25V_0402  [FP-0402-L_1_0_1-W_0_5_0_1-IPC_C]
C222  10uF_10V_0402  [FP-CL05A106MP5NUNC-MFG]
C223  0.1uF_25V_0402  [FP-0402-L_1_0_1-W_0_5_0_1-IPC_C]
C227  10uF_10V_0402  [FP-CL05A106MP5NUNC-MFG]
C228  0.1uF_25V_0402  [FP-0402-L_1_0_1-W_0_5_0_1-IPC_C]
C229  10uF_10V_0402  [FP-CL05A106MP5NUNC-MFG]
C230  0.1uF_25V_0402  [FP-0402-L_1_0_1-W_0_5_0_1-IPC_C]
C231  0.1uF_25V_0402  [FP-0402-L_1_0_1-W_0_5_0_1-IPC_C]
C232  10uF_10V_0402  [FP-CL05A106MP5NUNC-MFG]
C233  0.1uF_25V_0402  [FP-0402-L_1_0_1-W_0_5_0_1-IPC_C]
C235  0.1uF_25V_0402  [FP-0402-L_1_0_1-W_0_5_0_1-IPC_C]
C236  10uF_10V_0402  [FP-CL05A106MP5NUNC-MFG]
C237  0.1uF_25V_0402  [FP-0402-L_1_0_1-W_0_5_0_1-IPC_C]
C238  10uF_10V_0402  [FP-CL05A106MP5NUNC-MFG]
C239  0.1uF_25V_0402  [FP-0402-L_1_0_1-W_0_5_0_1-IPC_C]
C240  10uF_10V_0402  [FP-CL05A106MP5NUNC-MFG]
C241  0.1uF_25V_0402  [FP-0402-L_1_0_1-W_0_5_0_1-IPC_C]
C242  10uF_10V_0402  [FP-CL05A106MP5NUNC-MFG]
C243  0.1uF_25V_0402  [FP-0402-L_1_0_1-W_0_5_0_1-IPC_C]
C244  10uF_10V_0402  [FP-CL05A106MP5NUNC-MFG]
C245  0.1uF_25V_0402  [FP-0402-L_1_0_1-W_0_5_0_1-IPC_C]
C246  0.1uF_25V_0402  [FP-0402-L_1_0_1-W_0_5_0_1-IPC_C]
C247  10uF_10V_0402  [FP-CL05A106MP5NUNC-MFG]
C248  0.1uF_25V_0402  [FP-0402-L_1_0_1-W_0_5_0_1-IPC_C]
C249  0.1uF_25V_0402  [FP-0402-L_1_0_1-W_0_5_0_1-IPC_C]
C250  10uF_10V_0402  [FP-CL05A106MP5NUNC-MFG]
C251  0.1uF_25V_0402  [FP-0402-L_1_0_1-W_0_5_0_1-IPC_C]
C252  0.1uF_25V_0402  [FP-0402-L_1_0_1-W_0_5_0_1-IPC_C]
C253  10uF_10V_0402  [FP-CL05A106MP5NUNC-MFG]
C254  0.1uF_25V_0402  [FP-0402-L_1_0_1-W_0_5_0_1-IPC_C]
C255  10uF_10V_0402  [FP-CL05A106MP5NUNC-MFG]
C256  0.1uF_25V_0402  [FP-0402-L_1_0_1-W_0_5_0_1-IPC_C]
C257  10uF_10V_0402  [FP-CL05A106MP5NUNC-MFG]
C258  0.1uF_25V_0402  [FP-0402-L_1_0_1-W_0_5_0_1-IPC_C]
C259  0.1uF_50V_0402  [FP-C1005-050-0_05-IPC_C]
C260  10uF_10V_0402  [FP-CL05A106MP5NUNC-MFG]
C261  0.1uF_25V_0402  [FP-0402-L_1_0_1-W_0_5_0_1-IPC_C]
C262  10uF_10V_0402  [FP-CL05A106MP5NUNC-MFG]
C263  0.1uF_25V_0402  [FP-0402-L_1_0_1-W_0_5_0_1-IPC_C]
C264  10uF_25V_0603  [FP-CL10-IPC_C]
C265  0.1uF_50V_0402  [FP-C1005-050-0_05-IPC_C]
FB7  742792641  [FP-742792641-MFG]
L1  742792780  [SMD-0402]
L2  742792780  [SMD-0402]
L3  742792780  [SMD-0402]
L4  742792780  [SMD-0402]
L5  742792780  [SMD-0402]
L6  742792780  [SMD-0402]
L7  742792780  [SMD-0402]
L8  742792780  [SMD-0402]
L9  742792780  [SMD-0402]
L10  742792780  [SMD-0402]
L11  742792780  [SMD-0402]
L12  742792780  [SMD-0402]
L13  742792780  [SMD-0402]
L14  742792780  [SMD-0402]
L15  742792780  [SMD-0402]
L16  742792780  [SMD-0402]
L17  742792780  [SMD-0402]
L18  742792780  [SMD-0402]
L24  742792780  [SMD-0402]
R175  0_5%_0402  [RESC1005X40X25LL10T10]
R177  0_5%_0402  [RESC1005X40X25LL10T10]
R178  100_1%_0402  [RESC1005X40X25ML05T10]
R179  49.9_1%_0402  [RESC1005X40X25NL10T10]
R180  100_1%_0402  [RESC1005X40X25ML05T10]
R181  0_5%_0402  [FP-AC0402-0_37-IPC_B]
R182  4.7K_1%_0402  [RESC1005X40X25NL10T10]
R183  4.7K_1%_0402  [RESC1005X40X25NL10T10]
R184  4.7K_1%_0402  [RESC1005X40X25NL10T10]
R264  0_1%_0402  [RESC1005X40X25LL05T05]
R265  0_1%_0402  [RESC1005X40X25LL05T05]
Y1  ASEMPC-40.000MHZ-XR-T  [FP-ASEMP-CMOS-MFG]
Y2  Manufacturer Part Number: SiT5501AI-WU033JH-10.000000  [SITIME_SPL-086-CQFN-010-C07050_REV_DRAFT]  (hidden comment: SiTime_SiT5501AC-WU-33E0-10T)
Y6  TWETMCJANF-10.000000  [FP-TWETMCJANF-10_000000-MFG]

### Nets
DPLL_VDD_CLKA: C247.1 C248.1 L15.2
DPLL_VDD_CLKB: C232.1 C233.1 L11.2
DPLL_VDD_DCO_Q0123: C215.1 C216.1 L7.2
DPLL_VDD_DCO_Q4567: C229.1 C230.1 L10.2
DPLL_VDD_DIA_A: C61.1 C62.1 L3.2
DPLL_VDD_DIA_B: C80.1 C81.1 L4.2
DPLL_VDD_DIG: C63.1 C64.1 C68.1 C69.1 R175.2
DPLL_VDD_GPIO: C87.1 C88.1 C89.1 C90.1 R177.2
DPLL_VDDA_BG_LC: C71.1 C72.1 C73.1 L2.2
DPLL_VDDA_FB: C242.1 C243.1 L14.2
DPLL_VDDA_PDCP_XTAL: C170.1 C184.1 L6.2
DPLL_VDDO_Q0: C227.1 C228.1 L9.2
DPLL_VDDO_Q1: C244.1 C245.1 L13.2
DPLL_VDDO_Q2: C253.1 C254.1 L16.2
DPLL_VDDO_Q3: C262.1 C263.1 L18.2
DPLL_VDDO_Q4: C59.1 C60.1 L1.2
DPLL_VDDO_Q5: C84.1 C85.1 L5.2
DPLL_VDDO_Q6: C220.1 C221.1 L8.2
DPLL_VDDO_Q7: C238.1 C239.1 L12.2
GND: C55.2 C56.2 C59.2 C60.2 C61.2 C62.2 C63.2 C64.2 C68.2 C69.2 C71.2 C72.2 C73.2 C74.2 C75.2 C76.2 C77.2 C78.2 C79.2 C80.2 C81.2 C82.2 C83.2 C84.2 C85.2 C86.2 C87.2 C88.2 C89.2 C90.2 C170.2 C184.2 C207.2 C208.2 C209.2 C210.2 C211.2 C215.2 C216.2 C217.2 C218.2 C219.2 C220.2 C221.2 C222.2 C223.2 C227.2 C228.2 C229.2 C230.2 C231.2 C232.2 C233.2 C235.2 C236.2 C237.2 C238.2 C239.2 C240.2 C241.2 C242.2 C243.2 C244.2 C245.2 C246.2 C247.2 C248.2 C250.2 C251.2 C252.2 C253.2 C254.2 C255.2 C256.2 C257.2 C258.2 C259.1 C260.2 C261.2 C262.2 C263.2 C264.2 C265.1 R180.1 Y1.3(GND) Y2.5(GND) Y6.1(GND/NC) Y6.2(GND)
P1V8: C76.1 C77.1 C78.1 C86.1 C217.1 C231.1 C246.1 L3.1 L4.1 L7.1 L10.1 L14.1 R175.1
P3V3: C55.1 C56.1 C74.1 C75.1 C79.1 C82.1 C83.1 C207.1 C208.1 C209.1 C218.1 C219.1 C222.1 C223.1 C235.1 C236.1 C237.1 C240.1 C241.1 C250.1 C251.1 C252.1 C255.1 C256.1 C259.2 C260.1 C261.1 FB7.2 L1.1 L2.1 L5.1 L6.1 L8.1 L9.1 L11.1 L12.1 L13.1 L15.1 L16.1 L17.1 L18.1 L24.1 R177.1 R178.2 R183.2 R184.2
DPLL_CLKIN_5_P: R181.1 ; off-sheet DPLL_CLKIN_5_P
DPLL_OSCI: C249.2 ; off-sheet DPLL_OSCI
DPLL_XO: R265.2 ; off-sheet DPLL_XO
SiT5501_PLL_SCL: Y2.3(NC) ; off-sheet SiT5501_PLL_SCL
SiT5501_PLL_SDA: Y2.2(NC) ; off-sheet SiT5501_PLL_SDA
NetC210_1: C210.1 C211.1 L24.2 Y6.4(VDD)
NetC249_1: C249.1 R178.1 R179.2 R180.2
NetC257_1: C257.1 C258.1 L17.2 Y1.1(~{Tri-State}) Y1.6(VDD)
NetC264_1: C264.1 C265.2 FB7.1 R182.1 Y2.10(VDD)
NetR179_1: R179.1 Y1.4(Output)
NetR181_2: R181.2 Y2.6(CLK)
NetR182_2: R182.2 Y2.1(OE)
NetR183_1: R183.1 Y2.7(NC)
NetR184_1: R184.1 Y2.8(NC)
NetR264_1: R264.1 Y6.3(OUTPUT)
NetR264_2: R264.2 R265.1

Not connected (* = marked no-connect by the designer): Y2 4(NC) 9(NC)

### Layout directives
net class 50SE: NetR181_2

### Notes on the sheet
- 1.8V
- Input voltage supply for CLK4/CLK5/CLK6, Using 3.3V
- Input voltage supply for CLK0/CLK1/CLK2/CLK3, Using 3.3V
- 10MHz Source for DPLL

### Library data of the parts
C55 C59 C61 C63 C71 C74 C76 C80 C82 C84 C87 C170 C207 C210 C215 C218 C220 C222 C227 C229 C232 C236 C238 C240 C242 C244 C247 C250 C253 C255 C257 C260 C262 = CMP-13271-000002-1: as C52 on sheet 07-DPLL-1; Octopart: https://octopart.com/cl05a106mp5nunc-samsung-22457395; Voltage Rating: 10V; RoHS: TRUE; Value: 10uF; Height: 0.7mm; Digikey Description: CAP CER 10UF 10V X5R 0402; Automotive: No; Package: CL05A106MP5NUNC; Device Class L1: Passive Components; Capacitance: 10uF; Temperature Range High: +85°C; ComponentLink2Description: Datasheet; Device Class L2: Capacitors; Temperature Characteristic: X5R; Temperature: -55°C to +85°C; ComponentLink2URL: http://www.samsungsem.com/kr/support/product-search/mlcc/__icsFiles/afieldfile/2019/05/10/19-CL05A106MP5NUNC.pdf; Device Class L3: Ceramic Capacitors; Category: Cap; Temperature Range Low: -55°C; Ipc Land Pattern Name: CAPC10050X50; Lead Free: Yes
C56 C60 C62 C64 C68 C69 C72 C73 C75 C77-C79 C81 C83 C85 C86 C88-C90 C184 C208 C209 C211 C216 C217 C219 C221 C223 C228 C230 C231 C233 C235 C237 C239 C241 C243 C245 C246 C248 C249 C251 C252 C254 C256 C258 C261 C263 = CMP-2008-02519-2: as C19 on sheet 01-PCIe; Package Quantity: 1; Capacitance: 100nF; Min Operating Temperature: -55°C; Voltage: 25V; Voltage Rating: 25V; Construction: Flat; Max Operating Temperature: 125°C; Radiation Hardening: No; Depth: 0.5mm; Thickness: 0.022inch; Voltage Rating (DC): 25V; Number of Pins: 2; Lead Free: Lead Free; Series: -; REACH SVHC: No SVHC; Length: 1mm; Dielectric: X7R; RoHS Compliant: Yes; Mount: Surface Mount; Packaging: Tape and Reel; Case/Package: 0402; Case Code (Imperial): 0402; Termination: SMD/SMT; Width: 0.02inch; Case Code (Metric): 1005; Tolerance: 10%
C259 C265 = CMP-2000-05393-2: as C3 on sheet 01-PCIe; Voltage: 50V; Dielectric Material: Ceramic; Min Operating Temperature: -55°C; Depth: 0.5mm; Radiation Hardening: No; RoHS Compliant: Yes; Voltage Rating (DC): 50V; Lead Free: Lead Free; Resistor Type: Ceramic; Height: 0.5mm; Dielectric: X7R; Thickness: 0.022inch; Case/Package: 0402; Case Code (Metric): 1005; Termination: SMD/SMT; Capacitance: 100nF; Packaging: Tape and Reel; Max Operating Temperature: 125°C; Mount: Surface Mount; Package Quantity: 1; Width: 0.02inch; Weight: 2.3E-05oz; Voltage Rating: 50V; Tolerance: 10%; Construction: Flat; Case Code (Imperial): 0402; Length: 1mm; REACH SVHC: No SVHC; Series: C
C264 = CMP-13271-004224-1: Cap Ceramic 10uF 25V X5R ±20% Pad SMD 0603 +85°C T/R; Width: 0.031inch; Voltage Rating: 25V; Length: 0.063inch; Case Code (Metric): 1608; Dielectric: X5R; Termination: Wraparound; Capacitance: 10uF; Lead Free: Lead Free; Mount: Surface Mount; Package Quantity: 1; Case Code (Imperial): 0603; Thickness: 0.035inch; Packaging: Tape and Reel; Contact Plating: Tin; Min Operating Temperature: -55°C; Tolerance: 20%; Max Operating Temperature: 85°C; Case/Package: 0603
FB7 = CMP-0220-00171-2: FERRITE BEAD 300 OHM 0603 1LN; Inductance: 18nH; Max DC Current: 2A; Number of Lines: 1; Test Frequency: 100MHz; Impedance: 300R; DC Resistance (DCR): 150mR; Tolerance: 25%; Case Code (Metric): 1608; Core Material: Ferrite; Length: 1.6mm; Lead Free: Lead Free; Series: WE-CBF; Min Operating Temperature: -55°C; RoHS Compliant: Yes; Case/Package: SMD/SMT; Material: Ferrite; Max Operating Temperature: 125°C; Termination: SMD/SMT; Packaging: Tape and Reel; Weight: 0.000141oz; Case Code (Imperial): 0603; Width: 0.8mm; Mount: Surface Mount; Max Current Rating: 2A; Package Quantity: 1; Depth: 0.8mm; Current Rating: 2A; Height: 0.8mm
L1-L18 L24 = CMP-0220-00137-1: SMD EMI Suppression Ferrite Bead WE-CBF, Z = 220 Ohm; Impedance: 220 Ohm; PackageVersion: 2009; DatasheetVersion: ver 4, Jul-2009; PackageDescription: Chip Inductor, 2-Leads, Body 1.0 x 0.5 mm; ComponentLink1URL: http://www.we-online.com; ComponentLink1Description: Manufacturer Link; ComponentLink2URL: http://www.we-online.de/katalog/media/pdf/742792780.pdf; PackageReference: SMD-0402; ComponentLink2Description: Datasheet
R175 R177 = CMP-2002-04569-1: as R42 on sheet 01-PCIe
R178 R180 = CMP-2002-06458-1: as R9 on sheet 01-PCIe
R179 = CMP-2002-04448-1: as R43 on sheet 01-PCIe
R181 = CMP-2002-01772-2: RESISTOR 0402 JUMPER ZERO OHM; Voltage Rating: 50V; Temperature Coefficient: 200ppm/°C; Tolerance: 1%; Power Rating: 62.5mW; Resistance: 0R; Min Operating Temperature: -55°C; Termination: SMD/SMT; Case/Package: 0402; Case Code (Imperial): 0402; Packaging: Tape and Reel; Case Code (Metric): 1005; Max Operating Temperature: 155°C; Series: AC
R182-R184 = CMP-2002-05217-1: as R18 on sheet 01-PCIe
R264 R265 = CMP-2000-07451-1: as R1 on sheet 01-PCIe; Number of Terminations: 2; Mount: SurfaceMount; Height: 0.35mm; Packaging: TapeandReel; Contact Plating: Tin; Manufacturer URL: http://www.panasonic.com/; Composition: ThickFilm; Max Operating Temperature: 155degC; REACH SVHC: NoSVHC; Case/Package: 0402; Package Reference: 402; Depth: 0.5mm; Package Description: 2-Pin Surface Mount Device, Body 1 x 0.5 mm; Datasheet URL: https://industrial.panasonic.com/cdbs/www-data/pdf/RDA0000/AOA0000C301.pdf; RoHSCompliant: True; Case Code (Imperial): 0402; Military Standard: Not; Min Operating Temperature: -55degC; Power Rating: 100mW; Datasheet Version: 03/2015; Length: 1mm; Case Code (Metric): 1005; Termination: SMD/SMT; Mounting Technology: SurfaceMount; Voltage Rating: 50V; Width: 0.02inch; Package Quantity: 1; Lead Free: LeadFree; Radiation Hardening: No
Y1 = CMP-27762-012912-1: MEMS Oscillator 40MHz ±25ppm CMOS 2.25V~3.6V 6-SMD 3.2mm x 2.5mm; Max Supply Current: 35mA; Max Duty Cycle: 55%; Operating Supply Voltage: 3.3V; Max Supply Voltage: 3.6V; Load Capacitance: 15pF; Min Supply Voltage: 2.25V; Termination: SMD/SMT; Frequency: 40MHz; Length: 0.126inch; Case/Package: SMD/SMT; Max Operating Temperature: 105°C; RoHS Compliant: Yes; Mount: Surface Mount; Packaging: Tape and Reel; Number of Pins: 6; Width: 0.098inch; Min Operating Temperature: -40°C; Frequency Stability: 25ppm; Height: 0.035inch; Package Quantity: 1000
Y2 = CMP-OSC-00029-2: OSC, MEMS, STRATUM 3E, 10.000MHZ, 10PPB STAB, LVCMOS, 3.3V, O/P EN, 7.0X5.0X2.2MM, CQFN-10; Manufacturer: SiTime; Frequency: 10 MHz; Voltage - Supply: 3.3 V; Type: OCXO; Category: Oscillators; Max Operating Temperature: 70°C; Min Operating Temperature: -20°C; Height: 2.20mm (max); Case/Package: 10 Lead QFN; Output: LVCMOS; Mounting Type: Surface Mount; Frequency Stability: ±10 ppb; RoHS: Yes
Y6 = CMP-23139-000002-1: XTAL OSC TCXO 10.0000MHZ CMOS; Manufacturer: Taitien; Max Supply Current: 6mA; Stability: 0.1ppm; Load Capacitance: 15pF; Frequency: 10MHz; Max Supply Voltage: 3.465V; Min Supply Voltage: 3.135V; Package: 0; Category: Crys; Height: 1.65mm; Device Class L2: Crystals / Oscillators; Manufacturer Part Number: TWETMCJANF-10.000000; RoHS: TRUE; Device Class L1: Passive Components; Temperature Range High: +70°C; Lead Free: Yes; Series: TW; ComponentLink2URL: https://www.taitien.com/wp-content/uploads/2015/12/XO-0084_TW_TYPE_TCXO.pdf; Automotive: No; Temperature Range Low: -20°C; Octopart: https://octopart.com/twetmcjanf-10.000000-taitien-75080612; Temperature: -20°C to +70°C; Device Class L3: Oscillators; Digikey Description: XTAL OSC TCXO 10.0000MHZ CMOS; ComponentLink2Description: Datasheet